# EAGLE design vA-ESP32 (EAGLE 9.0.0)
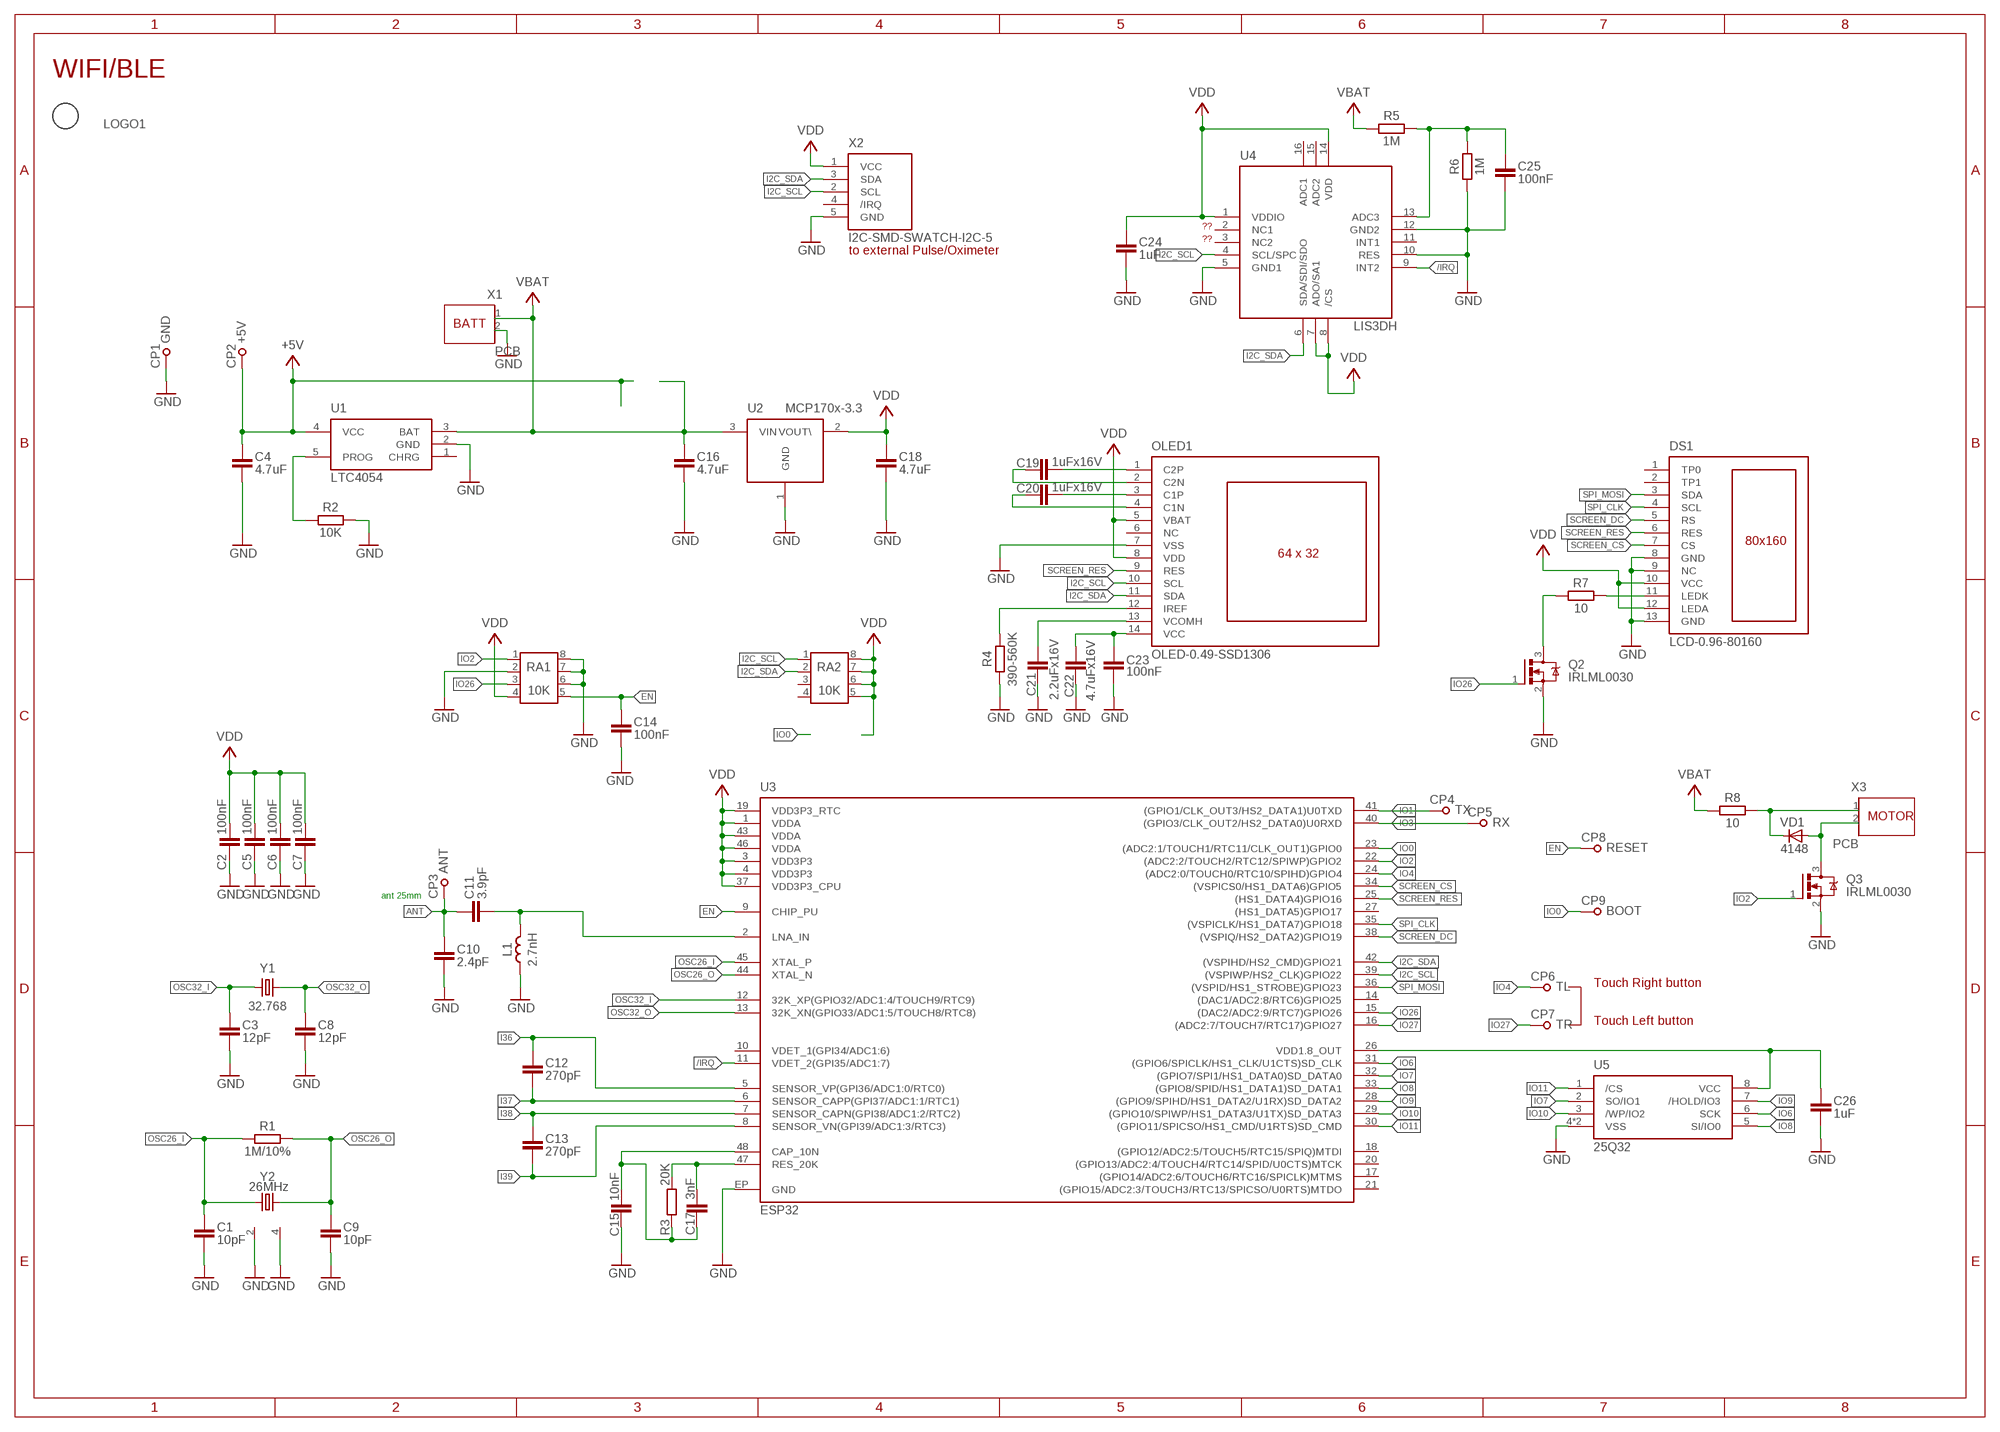
[diagram p0: schematic, sheet 1]

## Parts
C1  10pF  C-EU-C0402  [C0402]
C2  100nF  C-EU-C0402  [C0402]
C3  12pF  C-EU-C0402  [C0402]
C4  4.7uF  C-EU-C0603  [C0603]
C5  100nF  C-EU-C0603  [C0603]
C6  100nF  C-EU-C0402  [C0402]
C7  100nF  C-EU-C0402  [C0402]
C8  12pF  C-EU-C0402  [C0402]
C9  10pF  C-EU-C0402  [C0402]
C10  2.4pF  C-EU-C0402  [C0402]
C11  3.9pF  C-EU-C0402  [C0402]
C12  270pF  C-EU-C0402  [C0402]
C13  270pF  C-EU-C0402  [C0402]
C14  100nF  C-EU-C0402  [C0402]
C15  10nF  C-EU-C0402  [C0402]
C16  4.7uF  C-EU-C0603  [C0603]
C17  3nF  C-EU-C0402  [C0402]
C18  4.7uF  C-EU-C0603  [C0603]
C19  1uFx16V  C-EU-C0603  [C0603]
C20  1uFx16V  C-EU-C0603  [C0603]
C21  2.2uFx16V  C-EU-C0805  [C0805]
C22  4.7uFx16V  C-EU-C0805  [C0805]
C23  100nF  C-EU-C0603  [C0603]
C24  1uF  C-EU-C0402  [C0402]
C25  100nF  C-EU-C0402  [C0402]
C26  1uF  C-EU-C0603  [C0603]
CP1  GND  CP-1  [CP-1-R08MM]
CP2  +5V  CP-1  [CP-1-R08MM]
CP3  ANT  CP  [CP-1-C08MM]
CP4  TX  CP  [CP-1-C08MM]
CP5  RX  CP  [CP-1-C08MM]
CP6  TL  CP-CP-1-C25  [CP-1-C24MM]
CP7  TR  CP-CP-1-C25  [CP-1-C24MM]
CP8  RESET  CP  [CP-1-C08MM]
CP9  BOOT  CP  [CP-1-C08MM]
DS1  LCD-0.96-80160  [LCD-0.96-80*160]
FIDUCIAL1  FIDUCIAL-MICRO  [FIDUCIAL-MICRO]
L1  2.7nH  LL0402  [L0402]
LOGO1  LOGO6  [LOGO_OMEGA]
OLED1  OLED-0.49-SSD1306  [OLED_0.49-SSD1306]
Q2  IRLML0030  FET_NSOT23  [SOT23-3-1]
Q3  IRLML0030  FET_NSOT23  [SOT23-3-1]
R1  1M/10%  R-EU0402  [R0402]
R2  10K  R-EU0402  [R0402]
R3  20K  R-EU0402  [R0402]
R4  390-560K  R-EU0603  [R0603]
R5  1M  R-EU0402  [R0402]
R6  1M  R-EU0402  [R0402]
R7  10  R-EU0603  [R0603]
R8  10  R-EU0603  [R0603]
RA1  10K  R-ARRAY-4X0402  [EXB28V]
RA2  10K  R-ARRAY-4X0402  [EXB28V]
U1  LTC4054  [SOT23-5L]
U2  MCP170x-3.3  MCP170XSOT23  [SOT23-3]
U3  ESP32  [QFN48-6X6-0.4MM]
U4  LIS3DH  [LGA16]
U5  25Q32  25CXX-USON8-2X3  [USON-8-2X3]
VD1  4148  DIODESOD523  [SOD523]
X1  PCB  CON-2PSMD-2  [2C_SMD-SWATCH]
X2  I2C-SMD-SWATCH-I2C-5  [SMD-SWATCH-I2C-5]
X3  PCB  CON-2PSMD-2  [2C_SMD-SWATCH]
Y1  32.768  REZONATOR-2PIN3215  [XTAL3215]
Y2  26MHz  REZONATOR-4PIN-3225  [CRYSTAL-SMD-3225]

## Nets
+5V: C4.1 CP2.1(C1) U1.4(VCC)
/IRQ: U3.11(VDET_2(GPI35/ADC1:7)) U4.9(INT2)
ANT: C10.1 C11.1 CP3.1(C1)
EN: C14.1 CP8.1(C1) RA1.5 U3.9(CHIP_PU)
GND: C1.2 C2.2 C3.2 C4.2 C5.2 C6.2 C7.2 C8.2 C9.2 C10.2 C14.2 C15.2 C16.2 C18.2 C21.2 C22.2 C23.2 C24.2 C25.2 C26.2 CP1.1(C1) DS1.8(GND) DS1.9(NC) DS1.13(GND) L1.1(%1) OLED1.7(VSS) Q2.2(S) Q3.2(S) R2.2 R4.1 R6.1 RA1.2 RA1.6 RA1.7 RA1.8 U1.2(GND) U2.1(GND) U3.EP(GND) U4.5(GND1) U4.10(RES) U4.12(GND2) U5.4(VSS) U5.P$1(VSS) X1.2 X2.5(GND) Y2.2(S) Y2.4(S)
I2C_SCL: OLED1.10(SCL) RA2.1 U3.39((VSPIWP/HS2_CLK)GPIO22) U4.4(SCL/SPC) X2.2(SCL)
I2C_SDA: OLED1.11(SDA) RA2.2 U3.42((VSPIHD/HS2_CMD)GPIO21) U4.6(SDA/SDI/SDO) X2.3(SDA)
I36: C12.1 U3.5(SENSOR_VP(GPI36/ADC1:0/RTC0))
I37: C12.2 U3.6(SENSOR_CAPP(GPI37/ADC1:1/RTC1))
I38: C13.1 U3.7(SENSOR_CAPN(GPI38/ADC1:2/RTC2))
I39: C13.2 U3.8(SENSOR_VN(GPI39/ADC1:3/RTC3))
IO0: CP9.1(C1) U3.23((ADC2:1/TOUCH1/RTC11/CLK_OUT1)GPIO0)
IO1: CP4.1(C1) U3.41((GPIO1/CLK_OUT3/HS2_DATA1)U0TXD)
IO2: Q3.1(G) RA1.1 U3.22((ADC2:2/TOUCH2/RTC12/SPIWP)GPIO2)
IO3: CP5.1(C1) U3.40((GPIO3/CLK_OUT2/HS2_DATA0)U0RXD)
IO4: CP6.1(C1) U3.24((ADC2:0/TOUCH0/RTC10/SPIHD)GPIO4)
IO6: U3.31((GPIO6/SPICLK/HS1_CLK/U1CTS)SD_CLK) U5.6(SCK)
IO7: U3.32((GPIO7/SPI1/HS1_DATA0)SD_DATA0) U5.2(SO/IO1)
IO8: U3.33((GPIO8/SPID/HS1_DATA1)SD_DATA1) U5.5(SI/IO0)
IO9: U3.28((GPIO9/SPIHD/HS1_DATA2/U1RX)SD_DATA2) U5.7(/HOLD/IO3)
IO10: U3.29((GPIO10/SPIWP/HS1_DATA3/U1TX)SD_DATA3) U5.3(/WP/IO2)
IO11: U3.30((GPIO11/SPICSO/HS1_CMD/U1RTS)SD_CMD) U5.1(/CS)
IO26: Q2.1(G) RA1.3 U3.15((DAC2/ADC2:9/RTC7)GPIO26)
IO27: CP7.1(C1) U3.16((ADC2:7/TOUCH7/RTC17)GPIO27)
N$1: C20.2 OLED1.3(C1P)
N$2: C17.1 R3.1 U3.47(RES_20K)
N$3: C20.1 OLED1.4(C1N)
N$4: C15.1 C17.2 R3.2 U3.48(CAP_10N)
N$5: C19.1 OLED1.2(C2N)
N$6: R2.1 U1.5(PROG)
N$7: C11.2 L1.2(%2) U3.2(LNA_IN)
N$9: Q2.3(D) R7.1
N$10: C19.2 OLED1.1(C2P)
N$11: C22.1 C23.1 OLED1.14(VCC)
N$12: C21.1 OLED1.13(VCOMH)
N$14: OLED1.12(IREF) R4.2
N$17: DS1.11(LEDK) R7.2
N$22: Q3.3(D) VD1.A X3.2
N$23: R8.2 VD1.C X3.1
OSC26_I: C1.1 R1.1 U3.45(XTAL_P) Y2.1
OSC26_O: C9.1 R1.2 U3.44(XTAL_N) Y2.3
OSC32_I: C3.1 U3.12(32K_XP(GPIO32/ADC1:4/TOUCH9/RTC9)) Y1.1
OSC32_O: C8.1 U3.13(32K_XN(GPIO33/ADC1:5/TOUCH8/RTC8)) Y1.2
SCREEN_CS: DS1.7(CS) U3.34((VSPICS0/HS1_DATA6)GPIO5)
SCREEN_DC: DS1.5(RS) U3.38((VSPIQ/HS2_DATA2)GPIO19)
SCREEN_RES: DS1.6(RES) OLED1.9(RES) U3.25((HS1_DATA4)GPIO16)
SPI_CLK: DS1.4(SCL) U3.35((VSPICLK/HS1_DATA7)GPIO18)
SPI_MOSI: DS1.3(SDA) U3.36((VSPID/HS1_STROBE)GPIO23)
VBAT: C16.1 R5.1 R8.1 U1.3(BAT) U2.3(VIN) X1.1
VBAT_ADC: C25.1 R5.2 R6.2 U4.13(ADC3)
VDD: C2.1 C5.1 C6.1 C7.1 C18.1 C24.1 DS1.10(VCC) DS1.12(LEDA) OLED1.5(VBAT) OLED1.8(VDD) RA1.4 RA2.5 RA2.6 RA2.7 RA2.8 U2.2(VOUT\) U3.1(VDDA) U3.3(VDD3P3) U3.4(VDD3P3) U3.19(VDD3P3_RTC) U3.37(VDD3P3_CPU) U3.43(VDDA) U3.46(VDDA) U4.1(VDDIO) U4.7(ADO/SA1) U4.8(/CS) U4.14(VDD) X2.1(VCC)
VDD_SDIO: C26.1 U3.26(VDD1.8_OUT) U5.8(VCC)
Unconnected: DS1.1(TP0) DS1.2(TP1) OLED1.6(NC) RA2.3 RA2.4 U1.1(CHRG) U3.10(VDET_1(GPI34/ADC1:6)) U3.14((DAC1/ADC2:8/RTC6)GPIO25) U3.17((GPIO14/ADC2:6/TOUCH6/RTC16/SPICLK)MTMS) U3.18((GPIO12/ADC2:5/TOUCH5/RTC15/SPIQ)MTDI) U3.20((GPIO13/ADC2:4/TOUCH4/RTC14/SPID/U0CTS)MTCK) U3.21((GPIO15/ADC2:3/TOUCH3/RTC13/SPICSO/U0RTS)MTDO) U3.27((HS1_DATA5)GPIO17) U4.2(NC1) U4.3(NC2) U4.11(INT1) U4.15(ADC2) U4.16(ADC1) X2.4(/IRQ)

## Notes on the sheet
- WIFI/BLE
- ??
- ??
- to external Pulse/Oximeter
- BATT
- MOTOR
- ant 25mm
- Touch Right button
- Touch Left button

## Library data of the parts
C1-C26 = !ht3_passive:C-EU: CAPACITOR, European symbol
CP1-CP9 = !ht3_connectors:CP
DS1 = !ht3_modules:LCD-0.96-80*160
FIDUCIAL1 = !ht3_misc:FIDUCIAL: For use by pick and place machines to calibrate the vision/machine, 1mm By microbuilder.eu
L1 = !ht3_inductor:L
LOGO1 = !ht3_misc:LOGO
OLED1 = !ht3_modules:OLED-0.49-SSD1306
Q2 Q3 = !ht3_transistor:FET_N
R1-R8 = !ht3_passive:R-EU: RESISTOR, European symbol
RA1 RA2 = !ht3_passive:R-ARRAY-4X: Chip Resistor Array 4 Single Resistor Source: http://www.ctscorp.com/components/Datasheets/CTSChipArrayDs.pdf
U1 = !ht3_ic:LTC4054
U2 = !ht3_ic:MCP170X: http://ww1.microchip.com/downloads/en/DeviceDoc/20001826C.pdf Analog - XC6206
U3 = !ht3_ic:ESP32: Espressif ESP32 WiFi-compatible SoC microcontroller. Bluetooth Low energy support (BLE, BT4.0, Bluetooth Smart) 28 GPIO pins Dual-core Tensilica LX6 microprocessor Hardware accelerated encryption (AES, SHA2, ECC, RSA-4096) 4MB Flash memory 520kB internal SRAM Datasheet <https://cdn.sparkfun.com/datasheets/IoT/esp32_datasheet_en.pdf> SparkFun Products: SparkFun ESP32 Thing <https://www.sparkfun.com/products/13907>; PROD_ID: IC-13338
U4 = !ht3_ic:LIS3DH
U5 = !ht3_ic:25CXX
VD1 = !ht3_diode:DIODE: DIODE
X1 X3 = !ht3_connectors:CON-2P
X2 = !ht3_connectors:I2C
Y1 = !ht3_misc:REZONATOR-2PIN: CRYSTAL
Y2 = !ht3_misc:REZONATOR-4PIN: CRYSTAL

## Board
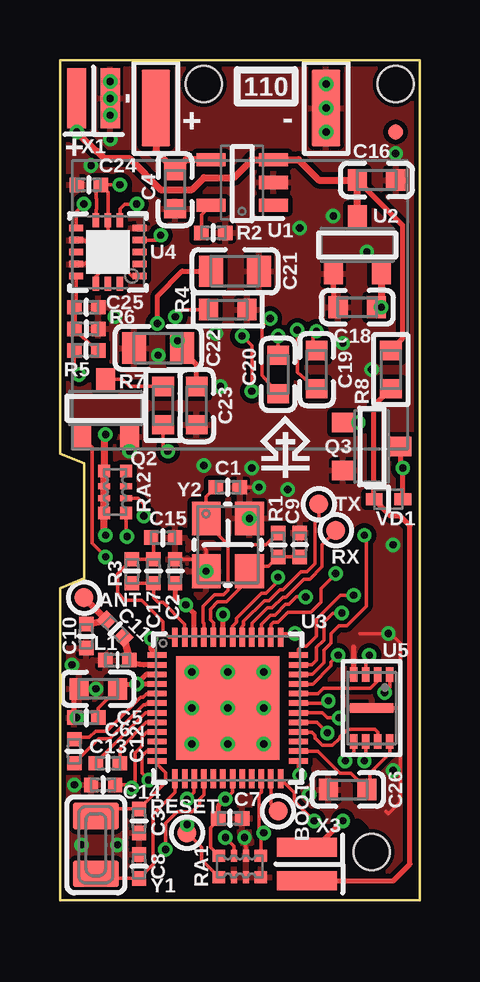
[diagram p1: board, top side]
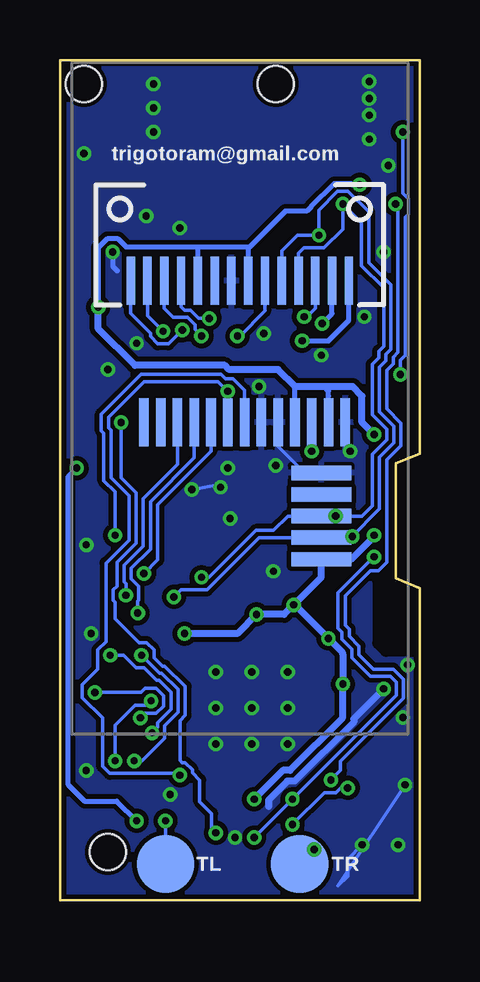
[diagram p2: board, bottom side, seen from below]

Size 15 x 35 mm. Coordinates in mm from the lower left corner, seen from the top.
Outline: 15,35 15,0 0,0 0,13 1,13.4 1,18.2 0,18.6 0,35 15,35
Copper layers (1*16): Top 0.035mm / dielectric 1.5mm / Bottom 0.035mm
Design rules "rules_MIN *": minimum track width 0.15mm, minimum drill 0.3mm, track to track 0.15mm, track to pad 0.15mm, pad to pad 0.15mm, via to via 0.15mm, smd to smd 0.08mm, copper to edge 0.2mm, drill to drill 0.2mm, minimum pad ring 0.1mm, minimum via ring 0.15mm, stop-mask expansion 4mil, vias tented up to drill 0.6mm, thermal gap 0.15mm
Holes 1.5 mm at 6,34 14,34 13,2
tRestrict: 8 lines
bRestrict: 3 lines

### Footprints (pad centres in the part's own frame; a part is rotated, then mirrored left to right if it is on the bottom)
C0402 = smd 0.6 x 0.6: 1 -0.5,0; 2 0.5,0
C0603 = smd 0.8 x 0.9: 1 -0.8,0; 2 0.8,0
C0805 = smd 1 x 1.3: 1 -1,0; 2 1,0
CP-1-R08MM = smd 1.2 x 3.2: 1 0,0
CP-1-C08MM = smd 0.8 x 0.8: 1 0,0
CP-1-C24MM = smd 2.4 x 2.4: 1 0,0
LCD-0.96-80*160 = smd 0.4 x 2: 1 -4,-4; 2 -3.3,-4; 3 -2.6,-4; 4 -1.9,-4; 5 -1.2,-4; 6 -0.5,-4; 7 0.2,-4; 8 0.9,-4; 9 1.6,-4; 10 2.3,-4; 11 3,-4; 12 3.7,-4; 13 4.4,-4
FIDUCIAL-MICRO = smd 0.635 x 0.635: 1 0,0
L0402 = smd 0.6 x 0.6: 1 -0.5,0; 2 0.5,0
OLED_0.49-SSD1306 = smd 0.35 x 2: 1 -4.55,0; 2 -3.85,0; 3 -3.15,0; 4 -2.45,0; 5 -1.75,0; 6 -1.05,0; 7 -0.35,0; 8 0.35,0; 9 1.05,0; 10 1.75,0; 11 2.45,0; 12 3.15,0; 13 3.85,0; 14 4.55,0
SOT23-3-1 = smd 0.8 x 0.9: 1 -1,-1.2; 2 1,-1.2; 3 0,1.2
R0402 = smd 0.6 x 0.6: 1 -0.5,0; 2 0.5,0
R0603 = smd 0.8 x 0.9: 1 -0.8,0; 2 0.8,0
EXB28V = smd 0.525 x 0.5: 1 -0.875,-0.45; 4 0.875,-0.45; 5 0.875,0.45; 8 -0.875,0.45 | smd 0.25 x 0.5: 2 -0.25,-0.45; 3 0.25,-0.45; 6 0.25,0.45; 7 -0.25,0.45
SOT23-5L = smd 0.55 x 1.2: 1 -0.95,-1.3; 2 0,-1.3; 3 0.95,-1.3; 4 0.95,1.3; 5 -0.95,1.3
SOT23-3 = smd 0.8 x 0.9: 1 -1,-1.2; 2 1,-1.2; 3 0,1.2
QFN48-6X6-0.4MM = smd 0.8 x 0.23: 1 -2.95,2.2; 2 -2.95,1.8; 3 -2.95,1.4; 4 -2.95,1; 5 -2.95,0.6; 6 -2.95,0.2; 7 -2.95,-0.2; 8 -2.95,-0.6; 9 -2.95,-1; 10 -2.95,-1.4; 11 -2.95,-1.8; 12 -2.95,-2.2; 25 2.95,-2.2; 26 2.95,-1.8; 27 2.95,-1.4; 28 2.95,-1; 29 2.95,-0.6; 30 2.95,-0.2; 31 2.95,0.2; 32 2.95,0.6; 33 2.95,1; 34 2.95,1.4; 35 2.95,1.8; 36 2.95,2.2 | smd 0.23 x 0.8: 13 -2.2,-2.95; 14 -1.8,-2.95; 15 -1.4,-2.95; 16 -1,-2.95; 17 -0.6,-2.95; 18 -0.2,-2.95; 19 0.2,-2.95; 20 0.6,-2.95; 21 1,-2.95; 22 1.4,-2.95; 23 1.8,-2.95; 24 2.2,-2.95; 37 2.2,2.95; 38 1.8,2.95; 39 1.4,2.95; 40 1,2.95; 41 0.6,2.95; 42 0.2,2.95; 43 -0.2,2.95; 44 -0.6,2.95; 45 -1,2.95; 46 -1.4,2.95; 47 -1.8,2.95; 48 -2.2,2.95 | smd 4.3 x 4.3: EP 0,0
LGA16 = smd 0.58 x 0.28: 1 -1.325,1; 2 -1.325,0.5; 3 -1.325,0; 4 -1.325,-0.5; 5 -1.325,-1; 9 1.325,-1; 10 1.325,-0.5; 11 1.325,0; 12 1.325,0.5; 13 1.325,1 | smd 0.28 x 0.58: 6 -0.5,-1.325; 7 0,-1.325; 8 0.5,-1.325; 14 0.5,1.325; 15 0,1.325; 16 -0.5,1.325
USON-8-2X3 = smd 0.6 x 0.3: 1 -1.4,0.75; 2 -1.4,0.25; 3 -1.4,-0.25; 4 -1.4,-0.75; 5 1.4,-0.75; 6 1.4,-0.25; 7 1.4,0.25; 8 1.4,0.75 | smd 0.4 x 1.8: P$1 0,0
SOD523 = smd 0.7 x 0.5: A 0.6,0; C -0.6,0
2C_SMD-SWATCH = smd 2.5 x 0.8: 1 -1.2,-0.7; 2 -1.2,0.7
SMD-SWATCH-I2C-5 = smd 0.6 x 2.5: 1 -1.8,0; 2 -0.9,0; 3 0,0; 4 0.9,0; 5 1.8,0
XTAL3215 = smd 1.1 x 1.9: 1 -1.2,0; 2 1.2,0
CRYSTAL-SMD-3225 = smd 1.4 x 1.2: 1 -1.1,-0.9; 2 1.1,-0.9; 3 1.1,0.9; 4 -1.1,0.9

### Placement (x,y rotation side)
C1  7,17.2 0 top
C2  4.8,13.7 90 top
C3  3.3,3.3 270 top
C4  4.8,29.6 270 top
C5  1.6,8.8 180 top
C6  1.1,7.6 180 top
C7  7.1,3.4 0 top
C8  3.3,1.4 90 top
C9  10,14.8 90 top
C10  1.1,11 270 top
C11  2.3,11.3 315 top
C12  0.6,6.2 270 top
C13  2,5.7 0 top
C14  1.8,4.8 180 top
C15  4.3,15.1 0 top
C16  13.2,30 0 top
C17  3.9,13.7 90 top
C18  12.4,24.7 180 top
C19  10.7,22.1 270 top
C20  9.1,21.9 90 top
C21  7.3,26.2 0 top
C22  4.1,23 180 top
C23  5.7,20.6 270 top
C24  1.2,29.8 180 top
C25  1.1,24.7 0 top
C26  12,4.6 180 top
CP1  11.1,33 0 top
CP2  4,33 0 top
CP3  1,12.6 180 top
CP4  10.8,16.5 90 top
CP5  11.5,15.4 90 top
CP6  10.6,1.5 0 bottom
CP7  5,1.5 0 bottom
CP8  5.3,2.8 0 top
CP9  9.1,3.7 180 top
DS1  7.5,23.9 0 bottom
FIDUCIAL1  14,32 180 top
L1  2.4,10 0 top
LOGO1  9.4,18.4 0 top
OLED1  7.5,25.8 0 bottom
Q2  1.9,20.5 0 top
Q3  13,18.9 270 top
R1  9.1,14.8 270 top
R2  6.4,27.8 0 top
R3  3,13.7 90 top
R4  7,24.6 180 top
R5  1.1,22.9 0 top
R6  1.1,23.8 180 top
R7  4.3,20.6 270 top
R8  13.8,22.1 270 top
RA1  7.5,1.4 180 top
RA2  2.3,17 90 top
U1  7.6,29.9 90 top
U2  12.4,27.3 0 top
U3  7,8 0 top
U4  2,27 180 top
U5  13,8 270 top
VD1  13.7,16.7 0 top
X1  1.4,32.2 270 top
X2  4.1,16 90 bottom
X3  11.5,1.5 0 top
Y1  1.5,2.3 270 top
Y2  7,14.8 270 top

### Tracks (layer width: path | path; a pad name or v marks a point on that pad's centre or on a via)
+5V
  Top 0.3: CP2.1 4,31.2 C4.1 5.25,30.85 U1.4
/IRQ  (via drill 0.3 pad 0.4)
  Top 0.15: U3.11 3.62,6.2 3.42,6.01 3.42,5.28 v3.7,5 | U4.9 0.68,28.68 v1,29
  Bottom 0.15: v1,29 0.9,28.9 0.9,22.82 1.1,22.62 1.1,22.34 1.38,22.07 1.38,20.47 0.78,19.87 0.78,18.93 1.38,18.33 1.38,14.08 1.73,13.73 2.05,13.73 3.1,12.68 3.1,11.45 2.94,11.28 2.94,10.99 2.52,10.58 2.52,10.22 1.93,9.62 1.1,9.62 0.68,9.2 0.68,8.4 3.3,5.78 3.3,5.4 v3.7,5
ANT
  Top 0.3: CP3.1 C11.1 C10.1
EN  (via drill 0.3 pad 0.4)
  Top 0.15: U3.9 3.62,7 3.42,6.81 3.42,6.43 3.12,6.13 3.12,4.92 3,4.8 | 6.58,0.8 RA1.5 5.9,1.68 5.9,2.2 CP8.1 5.2,2.9 v5.3,3.15 | v3,4.67 3,4.8 | C14.1 3,4.8
  Bottom 0.15: v3,4.67 3.29,4.67 3.48,4.47 3.98,4.47 v5.3,3.15
GND  (via drill 0.3 pad 0.4)
  Top 0.15: 6,14.7 6.1,14.6 Y2.2 5.6,14.2 C2.2 | U4.10 1,27.5 v1.5,27 1,26.5 U4.12 | 13.6,3.7 13.7,3.6 14.2,4.1 14.2,8 | 12.5,11.1 v13.7,11.1 13.8,11.1 14.2,10.7 14.2,8 | U5.P$1 14.2,8 | v2.4,2.3 2.6,2.5 | RA1.2 7.75,2.15 v7.7,2.6 | v8.3,17.2 C1.2
  Top 0.2: U5.4 12.25,10.55 | 8.3,16.3 Y2.4 | U2.1 11.4,24.5 C18.2 | C6.2 0.6,8.6 C5.2
  Bottom 0.15: v2.4,2.3 3,1.7 3,1 3.4,0.6 v0.6,4.8 | 3.1,18.8 DS1.13 3.1,18.9 v2.9,18.7 | DS1.9 5.9,18.9 4.8,17.8 | v9.5,17.1 8.4,17.3 v8.3,17.2
  Bottom 0.2: v12.8,27 12.8,26.4 12.6,26.2
  Bottom 0.3: v1.5,8.8 2.75,7.55 2.75,7.41 5.21,4.95 5.51,4.95 6.3,4.16 6.3,3.9
  other vias: 8.5,6.5 7,6.5 5.5,6.5 5.5,8 8.5,8 8.5,9.5 7,9.5 5.5,9.5 11.4,28.5 6,18.1 8,18 7.9,15.9 2.3,24.3 10.4,4.4 6.1,13.7 7,8 13.9,14.8 13,22.1 1.3,30.6 14,31.1 10,28 2.1,31.7 2.1,32.7 2.1,34.1 2.1,33.4 11.1,32 11.1,34 11.1,33 6.7,21.4 6.5,23.6 4.1,22.7 11.8,23.2 0.9,2.3 13.9,5.4 0.7,7.6 0.5,9.8
  pour Bottom (isolate 0.2): -2,37 -2,-2 17,-2 17,37
  pour Top (isolate 0.2): -1,41 16,41 16,-1 -1,-1
I2C_SCL  (via drill 0.3 pad 0.3, 0.3 pad 0.4)
  Top 0.15: U3.39 8.4,11.5 8.78,11.88 8.97,11.88 9.42,12.32 9.56,12.32 9.86,12.63 v10.25,12.63 | U4.4 4,27.5 v4.2,27.7 | RA2.1 2.75,15.2 v2.8,15.15
  Bottom 0.15: v10.25,12.63 9.95,12.93 8.88,12.93 6.7,15.1 X2.2 2.88,15.1 | OLED1.10 5.75,27.05 5.1,27.7 v4.2,27.7 4.2,28.74 3.42,29.52 2.98,29.52 2.12,28.67 2.12,26.55 1.2,25.63 1.2,22.95 1.4,22.75 1.4,22.47 1.68,22.19 1.68,20.34 1.07,19.74 1.07,19.06 1.68,18.46 1.68,16.3 2.88,15.1 | 2.88,15.1 2.9,15.07 v2.8,15.15
I2C_SDA  (via drill 0.3 pad 0.3, 0.3 pad 0.4)
  Top 0.15: RA2.2 3.25,16.75 3.5,16.5 v3.5,16 | v9.09,13.45 9.09,13.27 8.59,12.78 8.4,12.78 7.36,11.73 7.36,11.57 7.2,11.41 U3.42 | U4.6 2.5,28.8 2.7,29 v3.2,29
  Bottom 0.15: OLED1.11 5.05,26.95 4.83,27.18 3.98,27.18 3.2,27.96 v3.2,29 2.42,28.23 2.42,26.43 1.5,25.5 1.5,23.07 1.7,22.87 1.7,22.59 1.98,22.32 1.98,20.22 1.38,19.62 1.38,19.18 1.98,18.58 1.98,16.43 2.4,16 v3.5,16 X2.3 5.5,16 6.1,15.4 6.82,15.4 8.77,13.45 v9.09,13.45
I36
  Top 0.15: U3.5 3.62,8.6 3.46,8.44 3.36,8.44 1.95,7.03 1.48,7.03 1.23,6.77 0.67,6.77 C12.1
I37
  Top 0.15: U3.6 3.64,8.2 3.58,8.14 3.49,8.14 2.07,6.72 1.61,6.72 1.48,6.59 1.48,6.58 C12.2
I38
  Top 0.15: U3.7 3.57,7.8 1.6,5.83 C13.1
I39
  Top 0.15: U3.8 3.59,7.4 2.5,6.31 C13.2
IO0
  Top 0.15: U3.23 8.8,4 CP9.1
IO1
  Top 0.15: CP4.1 10.8,15.9 10.62,15.72 10.62,14.01 10.29,13.68 10.06,13.68 9.31,12.93 9.17,12.93 8.72,12.47 8.53,12.47 7.66,11.61 7.66,11.44 7.6,11.38 U3.41
IO2  (via drill 0.3 pad 0.4)
  Top 0.15: U3.22 8.4,4.5 8.3,4.4 8.3,3 v8.5,2.8 8.38,2.67 RA1.1 | v12.45,19.9 Q3.1
  Bottom 0.15: v8.5,2.8 8.68,2.98 8.68,3.6 9.18,4.1 9.18,5 9.47,5.3 9.47,5.42 9.78,5.72 9.9,5.72 10,5.83 10,7.48 9.78,7.7 9.78,8.9 10.63,9.75 10.73,9.75 11.07,10.1 11.07,10.42 11.38,10.72 11.7,10.72 12.7,11.72 12.7,12.4 12.78,12.48 12.78,12.92 12.62,13.07 12.62,14.07 11.82,14.87 11.82,16.98 12.45,17.6 v12.45,19.9
IO3
  Top 0.15: CP5.1 11.5,15.38 10.93,14.8 10.93,13.88 10.42,13.38 10.18,13.38 9.43,12.62 9.29,12.62 8.84,12.18 8.65,12.18 8,11.52 U3.40
IO4  (via drill 0.3 pad 0.4)
  Top 0.15: U3.24 9.78,4.47 9.78,4.12 v10.6,3.3
  Bottom 0.15: v10.6,3.3 CP6.1
IO6  (via drill 0.3 pad 0.3)
  Top 0.15: v12.7,5.8 12.75,5.85 U5.6 | U3.31 11.1,8.2 v11.2,8.3
  Bottom 0.15: v11.2,8.3 11.38,8.12 11.87,8.12 12.7,7.28 v12.7,5.8
IO7
  Top 0.15: U3.32 10.76,8.6 10.98,8.82 12.94,8.82 13.25,9.13 U5.2
IO8  (via drill 0.3 pad 0.3)
  Top 0.15: U3.33 10.55,9 11.3,9.75 11.3,9.9 v11.6,10.2 | U5.5 12.25,6.15 v11.9,5.8
  Bottom 0.15: v11.9,5.8 11.58,5.8 10.63,6.75 10.63,7.27 10.07,7.83 10.07,8.77 10.75,9.45 10.85,9.45 v11.6,10.2
IO9
  Top 0.15: U5.7 13.25,7 13.12,7.12 12.01,7.12 11.68,6.8 11.68,6.75 11.37,6.44 10.94,6.44 10.69,6.69 | U3.28 10.5,7 10.63,6.87 10.63,6.75 10.69,6.69 | 10.69,6.69
IO10  (via drill 0.3 pad 0.3)
  Top 0.15: U5.3 12.75,10.05 v12.9,10.2 | v11.16,6.97 10.72,7.4 U3.29
  Bottom 0.15: v12.9,10.2 12.34,10.2 11.82,9.68 11.5,9.68 10.97,9.15 10.88,9.15 10.38,8.65 10.38,7.95 10.93,7.39 10.93,7.19 v11.16,6.97
IO11  (via drill 0.3 pad 0.3)
  Top 0.15: v13.54,8.65 13.75,8.86 U5.1 | U3.30 10.96,7.8 11.17,7.59 v11.65,7.59
  Bottom 0.15: v11.65,7.59 11.46,7.78 10.98,7.78 10.68,8.08 10.68,8.52 10.98,8.82 11.44,8.82 11.62,8.65 v13.54,8.65
IO26  (via drill 0.3 pad 0.4)
  Top 0.15: v1.9,14.3 1.34,14.86 1.34,18.86 Q2.1 | U3.15 5.6,4.5 v5.3,4.2 | RA1.3 7.25,2.25 v6.9,2.6
  Bottom 0.15: v1.9,14.3 3.4,12.8 3.4,11.32 3.23,11.16 3.23,10.87 2.83,10.46 2.83,10.1 2.05,9.32 1.23,9.32 0.97,9.07 0.97,8.53 v5.3,4.2 v6.9,2.6
IO27  (via drill 0.3 pad 0.4)
  Top 0.15: v4.4,2.1 4.4,3.2 4.88,3.67 5.52,3.67 5.83,3.98 5.83,4.2 6,4.38 U3.16
  Bottom 0.15: v4.4,2.1 CP7.1
N$1  (via drill 0.3 pad 0.4)
  Top 0.15: C20.2 v9.1,23.5
  Bottom 0.15: OLED1.3 10.65,24.65 10.28,24.27 9.68,24.27 9.37,23.97 9.37,23.77 v9.1,23.5
N$2
  Top 0.15: U3.47 5.2,11.5 4.3,12.4 4.1,12.4 3.9,12.6 C17.1 R3.1
N$3  (via drill 0.3 pad 0.4)
  Top 0.15: C20.1 8.43,21.88 8.43,23.89 v8.77,24.23
  Bottom 0.15: OLED1.4 9.95,24.71 9.81,24.57 9.56,24.57 9.21,24.23 v8.77,24.23
N$4
  Top 0.15: U3.48 4.55,10.95 4.3,11.2 4.3,11.6 3.4,12.5 2.7,12.5 2.4,12.8 2.4,13.6 R3.2 C17.2 3.9,15 C15.1
N$5  (via drill 0.3 pad 0.4)
  Top 0.15: C19.1 10.55,22.95 10.55,23.55 v10.7,23.7
  Bottom 0.15: v10.7,23.7 11.35,24.35 OLED1.2
N$6
  Top 0.15: R2.1 5.9,28.55 U1.5
N$7
  Top 0.2: U3.2 3.5,9.8 arc-37 L1.2
  Top 0.3: C11.2 L1.2
N$9
  Top 0.15: R7.1 2.9,21.4 2.6,21.7 Q2.3
N$10  (via drill 0.3 pad 0.4)
  Top 0.15: C19.2 9.9,22 9.9,23.95 v9.9,23.75
  Bottom 0.15: v9.9,23.75 10.47,23.18 10.92,23.18 11.22,23.48 11.22,23.62 12.05,24.45 OLED1.1
N$11  (via drill 0.3 pad 0.4)
  Top 0.2: C23.1 5.7,22.3 5,23 | v4.9,23.3 4.9,23.1 5,23 | C22.1 5,23
  Bottom 0.2: v4.9,23.3 3.8,23.3 2.95,24.15 OLED1.14
N$12  (via drill 0.3 pad 0.4)
  Top 0.2: v4.06,24.02 4.06,25.16 5.1,26.2 C21.1
  Bottom 0.2: v4.06,24.02 3.65,24.44 OLED1.13
N$14  (via drill 0.3 pad 0.4)
  Top 0.15: v4.81,24.3 5.11,24.6 R4.2
  Bottom 0.15: OLED1.12 4.35,24.65 4.7,24.3 v4.81,24.3
N$17  (via drill 0.3 pad 0.4)
  Top 0.15: R7.2 4.3,18.9 v4.5,18.7
  Bottom 0.15: v4.5,18.7 DS1.11
N$22  (via drill 0.3 pad 0.4)
  Top 0.2: Q3.3 14.2,18.1 v14.3,18 VD1.A | v11.8,3.3 10.7,2.2 X3.2
  Bottom 0.2: v14.3,18 14.65,17.65 14.65,4.8 13.97,4.12 12.63,4.12 v11.81,3.31 v11.8,3.3
N$23
  Top 0.2: X3.1 13.9,0.8 14.6,1.5 14.6,15.6 14.2,16 13.8,16 VD1.C 13.1,20.6 R8.2
OSC26_I
  Top 0.15: Y2.1 6.1,16.8 C1.1 | 7,14.8 7,12.9 6.83,12.72 6.46,12.72 5.97,12.24 5.97,11.56 6,11.53 U3.45 | 7,14.8 6.1,15.7 | R1.1 8.6,14.8 7,14.8
  Top 0.2: 6.1,15.7 Y2.1
OSC26_O
  Top 0.15: C9.1 R1.2 8.7,13.9 8.1,13.9 Y2.3 7.9,13.38 6.95,12.43 6.58,12.43 6.28,12.12 6.28,11.68 6.4,11.56 U3.44
OSC32_I
  Top 0.15: U3.12 4.05,5.65 4.4,5.3 4.4,4.9 C3.1 1.8,3.8 Y1.1
OSC32_O
  Top 0.15: U3.13 4.8,4.5 3.88,3.58 3.88,1.78 3.92,1.73 3.92,1.52 C8.1 1.7,0.9 Y1.2
SCREEN_CS  (via drill 0.3 pad 0.4)
  Top 0.15: U3.34 10.52,9.4 11,9.88 11,10.4 11.3,10.7 11.3,11.1 11.63,11.43 11.97,11.43 12.78,12.23 12.78,15.12 v12.7,15.2
  Bottom 0.15: DS1.7 7.3,21.24 7.78,21.73 8.1,21.73 8.28,21.9 11.62,21.9 13.28,20.25 13.28,19.56 13.18,19.46 13.18,17.48 12.7,17 v12.7,15.2
SCREEN_DC  (via drill 0.3 pad 0.3)
  Top 0.15: U3.38 8.8,11.47 8.9,11.57 9.09,11.57 9.52,12 10.46,12 10.88,12.41 10.88,12.97 v11.5,13.6
  Bottom 0.15: DS1.5 8.7,18.7 10.93,16.48 10.93,14.18 v11.5,13.6
SCREEN_RES  (via drill 0.3 pad 0.3, 0.3 pad 0.4)
  Top 0.15: U3.25 9.95,5.25 v10,5.2 | v7.6,23.5 8,23.1 v8,21.2
  Bottom 0.15: v10,5.2 10.07,5.28 12.92,5.28 13.22,5.58 13.22,7.59 14.07,8.43 14.07,8.97 13.43,9.61 13.43,10.42 13.07,10.77 13.07,14.04 12.12,14.99 12.12,16.85 12.88,17.6 12.88,19.58 12.97,19.68 12.97,20.12 11.5,21.6 8.4,21.6 v8,21.2 DS1.6 | OLED1.9 6.45,24.55 7.5,23.5 v7.6,23.5
SPI_CLK  (via drill 0.3 pad 0.3)
  Top 0.15: U3.35 10.5,9.8 10.7,10 10.7,10.52 11,10.82 11,11.58 11.38,11.96 v11.76,11.96
  Bottom 0.15: v11.76,11.96 11.76,12.45 11.72,12.48 11.72,13.08 11.82,13.18 12.03,13.38 12.03,13.82 11.22,14.62 11.22,16.6 9.4,18.42 DS1.4
SPI_MOSI  (via drill 0.3 pad 0.3)
  Top 0.15: U3.36 9.95,10.45 10.07,10.57 10.28,10.57 10.7,11 10.7,11.7 11.7,12.7 v12.25,12.7
  Bottom 0.15: v12.25,12.7 12.25,13.18 12.32,13.26 12.32,13.94 11.53,14.74 11.53,16.72 10.1,18.15 DS1.3
VBAT  (via drill 0.3 pad 0.4)
  Top 0.15: R5.1 0.6,22.1 v0.8,21.9
  Top 0.2: R8.1 14.3,23.4 14.3,28.1 C16.1
  Top 0.3: X1.1 v0.7,32 1.5,31.2 1.55,31.2 1.85,30.9 2.9,30.9 4.2,29.6 5.5,29.6 6,30.1 7.25,30.1 8,30.85 U1.3 9.95,30.85 10.8,30 C16.1 U2.3
  Bottom 0.15: v0.8,21.9 0.8,22.5 0.6,22.7 0.6,28.46 0.47,28.58 0.47,29.22 0.7,29.44 v0.7,32
VBAT_ADC
  Top 0.15: C25.1 0.68,24.77 U4.13 | R6.2 0.97,23.43 0.99,23.43 1.52,22.9 R5.2
  Top 0.2: C25.1 R6.2
VDD  (via drill 0.3 pad 0.3, 0.3 pad 0.4)
  Top 0.15: C6.1 1.6,8 C5.1 | U4.14 1.5,26 1.8,26.3 2.2,26.3 | 2.2,26.3 2.7,26.3 3,26 U4.1 | v9.8,11.1 9.35,11.1 U3.37 | 2.2,26.3 2.2,27.5 2,27.7 U4.7 2,29.5 C24.1 | C24.1 v2.5,29.8 | C24.1 1.5,29.6 1.5,29.24 1.52,29.22 1.52,28.78 1.5,28.76 U4.8 | U3.19 7.2,4.5 v6.9,4.2 | C7.1 6.5,3.24 6.28,3.02 6.28,2.2 RA1.4
  Top 0.2: U3.46 5.6,11.95 v5.25,12.3 5.1,12.3 4.8,12.6 C2.1 | U3.43 v6.8,11.9 | U3.1 3.8,10.45 v3.8,10.9 | C18.1 13.4,24.5 | U3.4 v3.2,9 | v3.2,9 3.6,9.4 U3.3 | C5.1 2.6,9 v3.2,9 | v6.9,4.2 6.6,3.9 C7.1
  Top 0.3: v1.9,19.4 1.85,19.35 RA2.5 RA2.6 RA2.7 RA2.8 1.85,15.25 v1.9,15.2 | U2.2 v13.4,24.7 C18.1
  Bottom 0.2: v3.8,10.9 3.85,10.9 3.2,10.25 | v9.8,11.1 9.85,11.05 | 3.8,21 DS1.12 3.8,21.2 4,21.4 | DS1.10 5.2,21.4 | 2.4,29.8 v2.5,29.8 2.8,29.8 2.85,29.85 3.55,29.85 4.53,28.88 4.7,28.7 5.6,28.7 7.1,27.2 | OLED1.8 7.15,27.15 7.1,27.2 | 7.1,27.2 9.3,27.2 | 9.3,27.2 12.22,27.2 12.57,27.55 13.03,27.55 13.4,27.18 v13.4,24.7 | OLED1.5 9.25,27.15 9.3,27.2
  Bottom 0.3: v6.9,4.2 5.7,5.4 5.4,5.4 3.2,7.6 v3.2,9 3.2,10.25 | 3.2,10.3 v3.8,10.9 5.2,12.3 v5.25,12.3 | v5.25,12.3 5.65,11.9 v6.8,11.9 7.6,11.1 v9.8,11.1 | v5.25,12.3 4.1,13.45 X2.1 2.85,14.2 1.95,15.1 1.9,15.1 v1.9,15.2 | v1.9,19.4 2.4,19.9 2.4,21 2.8,21.4 4,21.4 5.2,21.4 5.9,22.1 7.95,22.1 8.12,22.27 11.88,22.27 13.4,23.8 v13.4,24.7
VDD_SDIO
  Top 0.15: U3.26 10.76,6.2 11.68,5.28 12.12,5.28 C26.1 12.92,4.72 12.92,5.28 13.75,6.11 U5.8
  Top 0.2: C26.1 12.8,4.9

### Text on the board
tPlace: 110 | - | - | + | +
bNames: trigotoram@gmail.com